# Altium project ReceiverLoRaRev1.PrjPcb
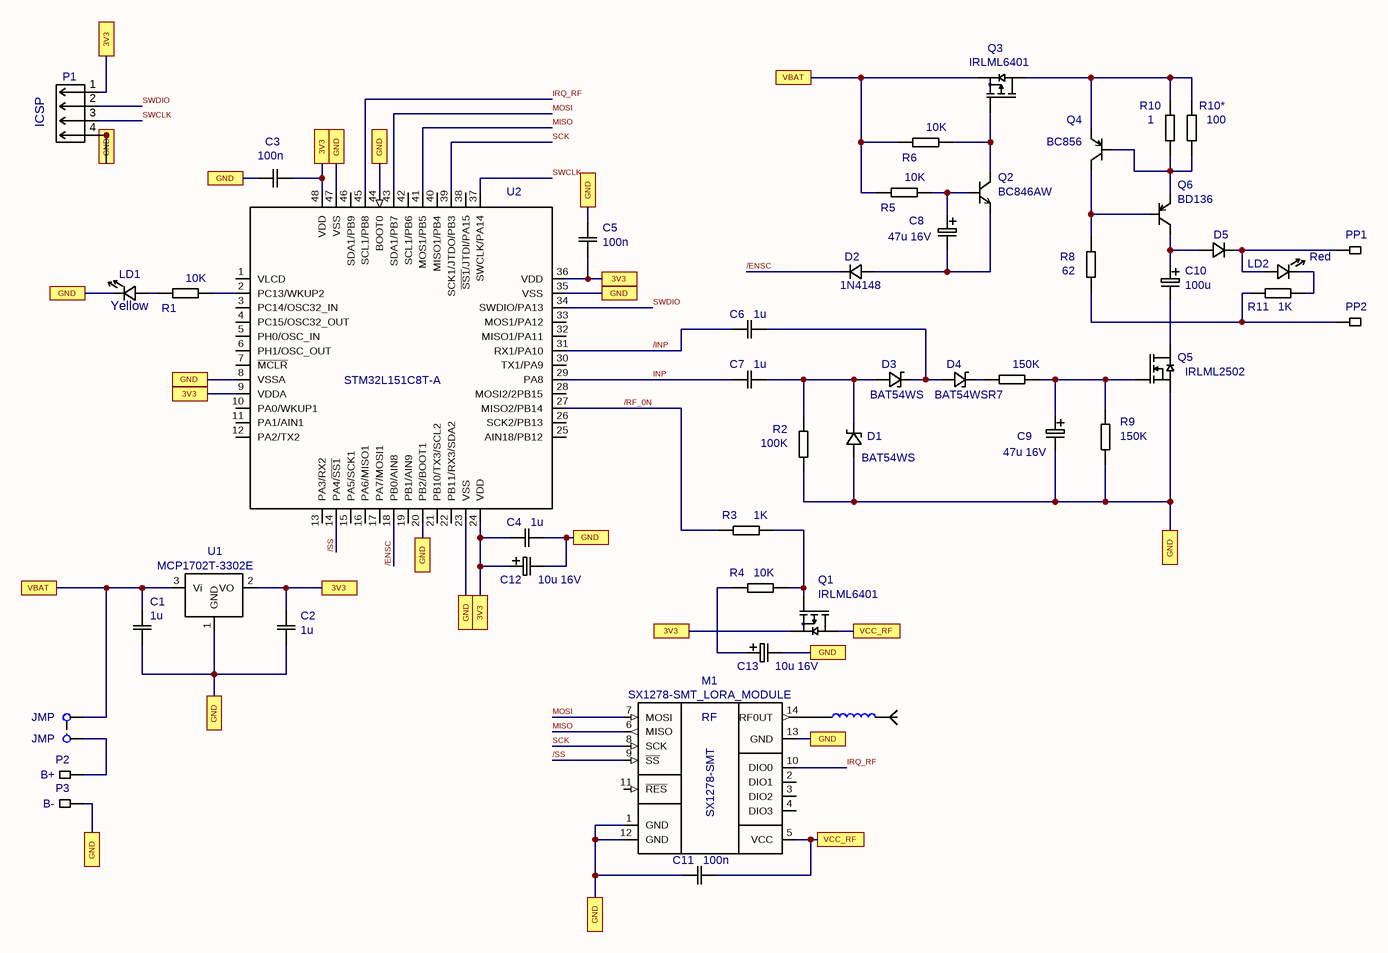
[diagram p0: Sheet1.SCHDOC]
1 sheet, 48 parts. Net scope: global (net labels, ports and power ports of the same name join across sheets).
Board file: ReceiverLoRaRev2.PcbDoc

## Sheet Sheet1.SCHDOC
size 420 x 297 mm; SheetNumber: 1; SheetTotal: 1; DocumentName: Sheet1.SCHDOC

### Parts
C1  value 1u  [C0805]  (hidden comment: CAP_SMD_0805)
C2  value 1u  [C0805]  (hidden comment: CAP_SMD_0805)
C3  value 100n  [C0805]  (hidden comment: CAP_SMD_0805)
C4  value 1u  [C0805]  (hidden comment: CAP_SMD_0805)
C5  value 100n  [C0805]  (hidden comment: CAP_SMD_0805)
C6  value 1u  [C0805]  (hidden comment: CAP_SMD_0805)
C7  value 1u  [C0805]  (hidden comment: CAP_SMD_0805)
C8  value 47u 16V  [ECAP-SD-D5L11]  (hidden comment: ECAP-RD-D5L11)
C9  value 47u 16V  [ECAP-SD-D5L11]  (hidden comment: ECAP-RD-D5L11)
C10  value 100u  [ECAP-SD-D6.3L11]  (hidden comment: ECAP-RD-D6.3L11)
C11  value 100n  [C0805]  (hidden comment: CAP_SMD_0805)
C12  value 10u 16V  [ECAP-SD-D5L11]  (hidden comment: ECAP-RD-D5L11)
C13  value 10u 16V  [ECAP-SD-D5L11]  (hidden comment: ECAP-RD-D5L11)
D1  BAT54WS  [SOD323]
D2  1N4148  [SOD80]
D3  BAT54WS  [SOD323]
D4  BAT54WS  [SOD323]
D5  1N4007-A7  [SOD-123FL]  (value not drawn)
LD1  value Yellow  [LED_SMD_0805]  (hidden comment: FYLS-0805BYC LED)
LD2  value Red  [LED_SMD_0805]  (hidden comment: FYLS-0805URC LED)
M1  SX1278-SMT_LORA_MODULE  [SX1278-SMT_MODULE]
P1  value ICSP  [PLS-04SMD]  (hidden comment: PLS-04SMD)
P2  value B+  [PAD_RRX60Y120D0T]  (hidden comment: PAD_RRX60Y120D0T)
P3  value B-  [PAD_RRX60Y120D0T]  (hidden comment: PAD_RRX60Y120D0T)
PP1  PAD_RRX60Y120D0T  [PAD_RRX60Y120D0T]  (value not drawn)
PP2  PAD_RRX60Y120D0T  [PAD_RRX60Y120D0T]  (value not drawn)
PP3  value JMP  [PAD_RX60Y60D38A]  (hidden comment: PAD_RX60Y60D38A)
PP4  value JMP  [PAD_RX60Y60D38A]  (hidden comment: PAD_RX60Y60D38A)
Q1  IRLML6401  [SOT23]
Q2  BC846AW  [SOT23]
Q3  IRLML6401  [SOT23]
Q4  BC856  [SOT23]
Q5  IRLML2502  [SOT23]
Q6  BD136  [TO225 VH]
R1  value 10K  [R0805]  (hidden comment: RES_SMD_0805)
R2  value 100K  [R0805]  (hidden comment: RES_SMD_0805)
R3  value 1K  [R0805]  (hidden comment: RES_SMD_0805)
R4  value 10K  [R0805]  (hidden comment: RES_SMD_0805)
R5  value 10K  [R0805]  (hidden comment: RES_SMD_0805)
R6  value 10K  [R0805]  (hidden comment: RES_SMD_0805)
R7  value 150K  [R0805]  (hidden comment: RES_SMD_0805)
R8  value 62  [R0805]  (hidden comment: RES_SMD_0805)
R9  value 150K  [R0805]  (hidden comment: RES_SMD_0805)
R10  value 1  [R0805]  (hidden comment: RES_SMD_0805)
R10*  value 100  [R0805]  (hidden comment: RES_SMD_0805)
R11  value 1K  [R0805]  (hidden comment: RES_SMD_0805)
U1  MCP1702T-3302E  [SOT23A]
U2  STM32L151C8T-A  [LQFP48 7X7]

### Ports
3V3, GND, VBAT, VCC_RF

### Nets
3V3: C2.2(B) C3.1(A) C4.2(B) C5.1(A) C12.1 P1.1 Q1.2(S) U1.2(VO) U2.9(VDDA) U2.24(VDD) U2.36(VDD) U2.48(VDD) ; port 3V3
/ENSC: D2.K U2.18(PB0/AIN8)
/INP: C6.2(B) U2.31(RX1/PA10)
/RF_0N: R3.2 U2.27(MISO2/PB14)
/SS: M1.9(~{SS}) U2.14(PA4/~{SS1})
GND: C1.1(A) C2.1(A) C3.2(B) C4.1(A) C5.2(B) C9.2 C11.1(A) C12.2 C13.2 D1.1 LD1.K M1.1(GND) M1.12(GND) M1.13(GND) P1.4 P3.1 Q5.2(S) R2.2 R9.2 U1.1(GND) U2.8(VSSA) U2.20(PB2/BOOT1) U2.23(VSS) U2.35(VSS) U2.44(BOOT0) U2.47(VSS) ; port GND
INP: C7.1(A) U2.29(PA8)
IRQ_RF: M1.10(DIO0) U2.45(SCL1/PB8)
MISO: M1.6(MISO) U2.41(MOS1/PB5)
MOSI: M1.7(MOSI) U2.43(SDA1/PB7)
SCK: M1.8(SCK) U2.39(SCK1/JTDO/PB3)
SWCLK: P1.3 U2.37(SWCLK/PA14)
SWDIO: P1.2 U2.34(SWDIO/PA13)
VBAT: C1.2(B) PP4.1 Q3.2(S) R5.2 R6.2 U1.3(Vi) ; port VBAT
VCC_RF: C11.2(B) M1.5(VCC) Q1.3(D) ; port VCC_RF
NetC6_1: C6.1(A) D3.2 D4.1
NetC7_2: C7.2(B) D1.2 D3.1 R2.1
NetC8_1: C8.1 Q2.1(B) R5.1
NetC8_2: C8.2 D2.A Q2.2(E)
NetC9_1: C9.1 Q5.1(G) R7.1 R9.1
NetC10_1: C10.1 D5.1(A) Q6.2(K)
NetC10_2: C10.2 Q5.3(D)
NetC13_1: C13.1 R4.2
NetD4_2: D4.2 R7.2
NetD5_2: D5.2(K) LD2.A PP1.1
NetLD1_A: LD1.A R1.2
NetLD2_K: LD2.K R11.1
NetP2_1: P2.1 PP3.1
NetPP2_1: PP2.1 R8.2 R11.2
NetQ1_1: Q1.1(G) R3.1 R4.1
NetQ2_3: Q2.3(C) Q3.1(G) R6.1
NetQ3_3: Q3.3(D) Q4.2(E) R10.1 R10*.1
NetQ4_1: Q4.1(B) Q6.1(E) R10.2 R10*.2
NetQ4_3: Q4.3(C) Q6.3(B) R8.1
NetR1_1: R1.1 U2.2(PC13/WKUP2)

Not connected (* = marked no-connect by the designer): M1 2(DIO1) 3(DIO2) 4(DIO3) 11(~{RES}) 14(RF0UT); U2 1(VLCD) 3(PC14/OSC32_IN) 4(PC15/OSC32_OUT) 5(PH0/OSC_IN) 6(PH1/OSC_OUT) 7(~{MCLR}) 10(PA0/WKUP1) 11(PA1/AIN1) 12(PA2/TX2) 13(PA3/RX2) 15(PA5/SCK1) 16(PA6/MISO1) 17(PA7/MOSI1) 19(PB1/AIN9) 21(PB10/TX3/SCL2) 22(PB11/RX3/SDA2) 25(AIN18/PB12) 26(SCK2/PB13) 28(MOSI2/2PB15) 30(TX1/PA9) 32(MISO1/PA11) 33(MOS1/PA12) 38(~{SS1}/JTDI/PA15) 40(MISO1/PB4) 42(SCL1/PB6) 46(SDA1/PB9)

### Notes on the sheet
- Перв. примен.
- Справ. №
- Подп. и дата
- Инв. № дубл.
- Взам. инв. №
- Изм.
- Лист
- № докум.
- Подп.
- Дата
- Лит.
- Масса
- Масштаб
- Т.контр.
- Пров.
- Разраб.
- Листов
- Инв. № подл.
- Н.контр.
- Утв.
- Копировал
- Формат А3
- (in symbol SX1278-SMT_LORA_MODULE) RF; SX1278-SMT

### Library data of the parts
LD1 = FYLS-0805BYC LED: Yellow LED. 2.6Vf
LD2 = FYLS-0805URC LED: Ultra Red. Vf-1.85V(2.2V max)
D1 D3 D4 = BAT54WS: Value: *
D2 = 1N4148: Value: *
D5 = 1N4007-A7: Value: *
M1 = SX1278-SMT_LORA_MODULE: Value: *
Q1 Q3 = IRLML6401: Value: *
Q2 = BC846AW: Value: *
Q4 = BC856: Value: *
Q5 = IRLML2502: Value: *
Q6 = BD136: Value: *
U1 = MCP1702T-3302E: Value: *
U2 = STM32L151C8T-A: Value: *